# EAGLE design 450_mic (EAGLE 9.6.2)
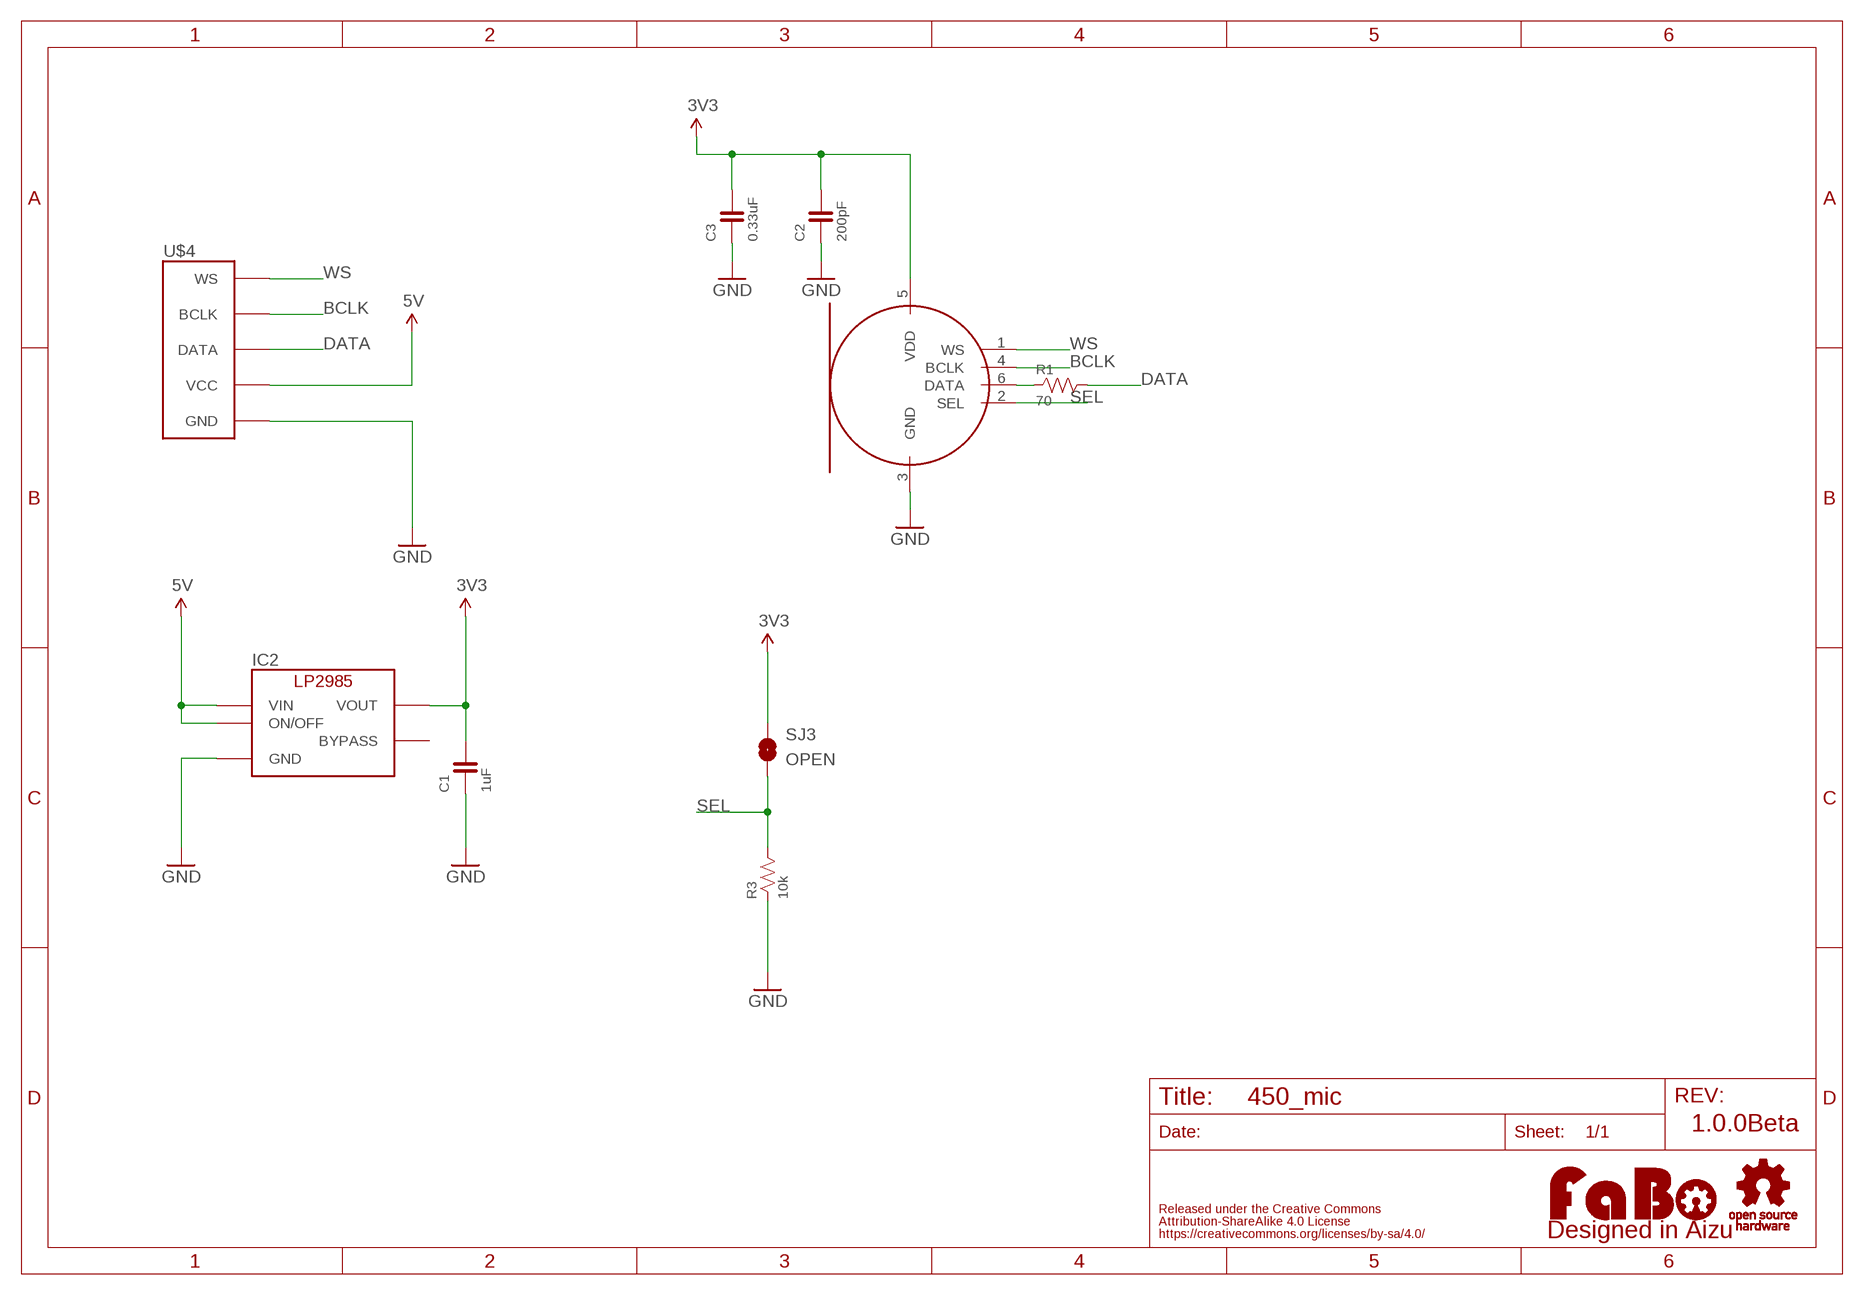
[diagram p0: schematic, sheet 1]

## Parts
C1  1uF  CAPACITOR-0603  [0603]
C2  200pF  CAPACITOR-0603  [0603]
C3  0.33uF  CAPACITOR-0603  [0603]
IC2  LP2985-33DBV  [SOT-23-5]
LOGO1  LOGO_FABO-M_BOTTOM  [LOGO_FABO_M_BOTTOM]
MIC1  KW-SPH0645  [KNOWLES-SPH0645]
R1  70  RESISTOR-0603  [0603]
R3  10k  RESISTOR-0603  [0603]
SJ3  OPEN  SMD-JUMPER-2-OPEN  [SMD-JUMPER-2-OPEN]
U$2  LOGO_OSHW-M_BOTTOM  [LOGO_OSHW_M_BOTTOM]
U$4  FABO_BRICK_I2S  [FABO_BRICK_I2S]

## Nets
3V3: C1.2 C2.2 C3.2 IC2.5(VOUT) MIC1.5(VDD) SJ3.1
5V: IC2.1(VIN) IC2.3(ON/OFF) U$4.VCC
BCLK: MIC1.4(BCLK) U$4.BCLK
DATA: R1.2 U$4.DATA
GND: C1.1 C2.1 C3.1 IC2.2(GND) MIC1.3(GND) R3.1 U$4.GND
N$6: MIC1.6(DATA) R1.1
SEL: MIC1.2(SEL) R3.2 SJ3.2
WS: MIC1.1(WS) U$4.WS
Unconnected: IC2.4(BYPASS)

## Notes on the sheet
- 1.0.0Beta

## Library data of the parts
C1-C3 = FaBo-Capacitor:CAPACITOR: CAPACITOR
IC2 = FaBo-Supply:LP2985: LP2985
LOGO1 = component:LOGO_FABO
MIC1 = FaBo-Mems:KW-SPH0645
R1 R3 = FaBo-Resistors:RESISTOR: RESISTOR
SJ3 = FaBo-Supply:SMD-JUMPER-2
U$2 = component:LOGO_OSHW
U$4 = FaBo-Template:FABO_BRICK_I2S

## Board
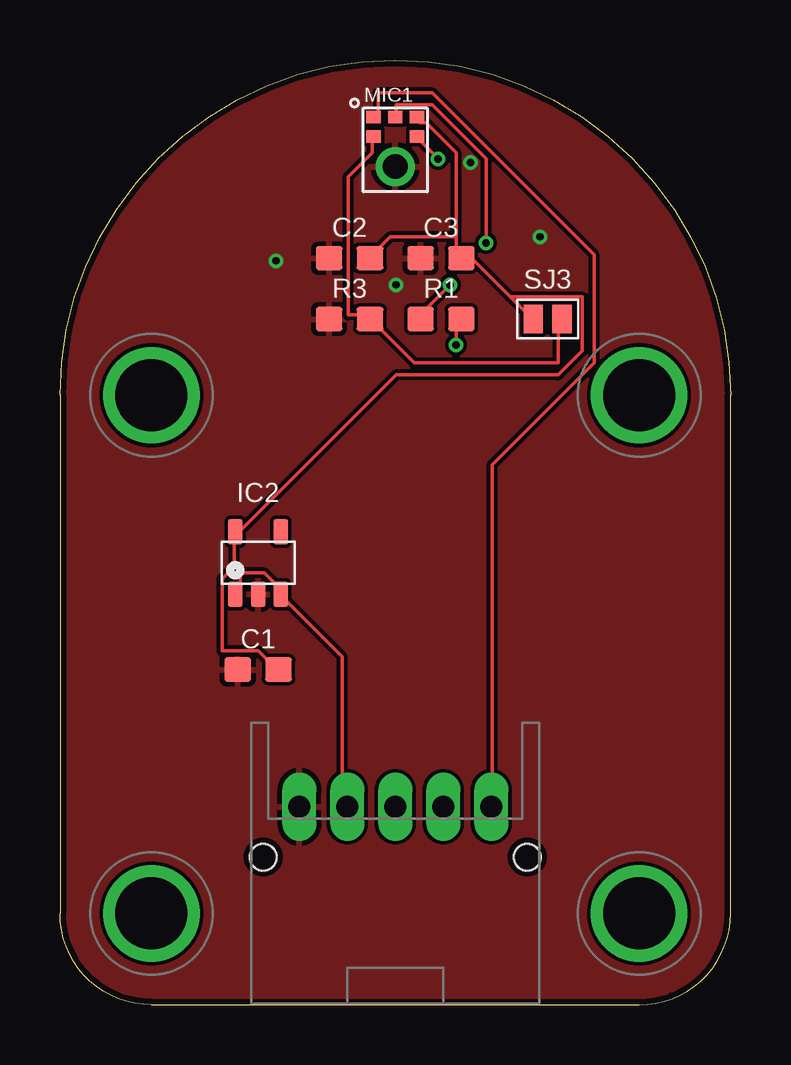
[diagram p1: board, top side]
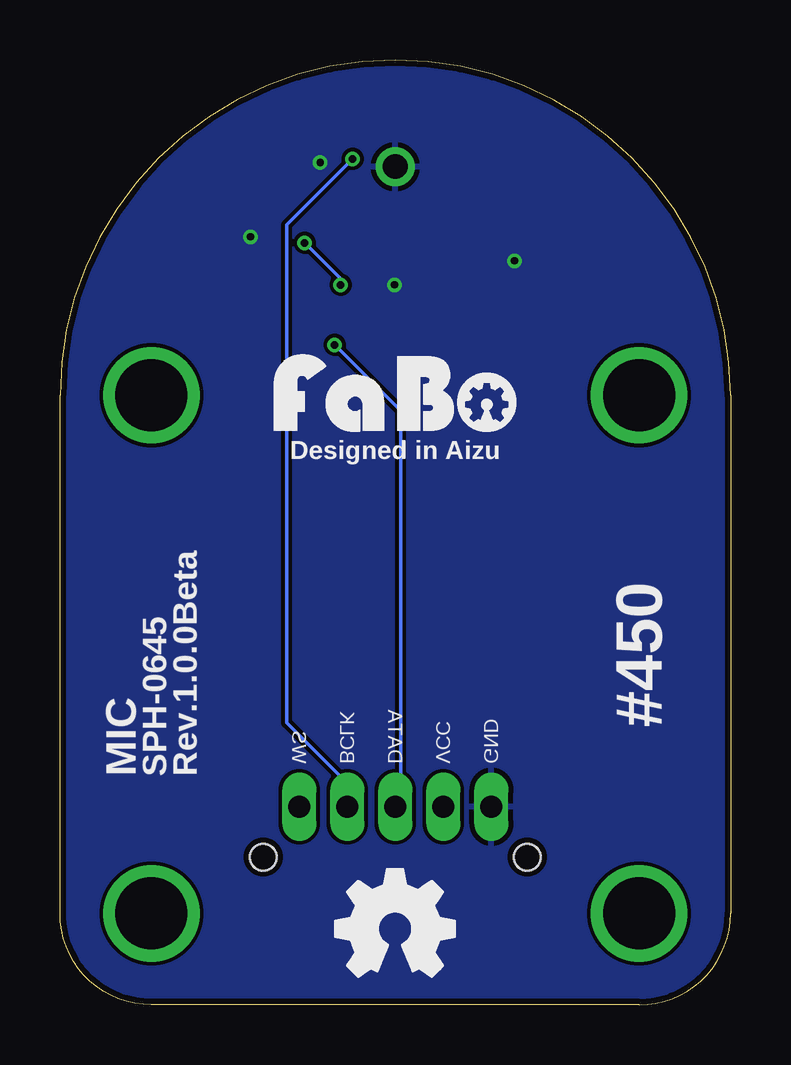
[diagram p2: board, bottom side, seen from below]

Size 27.94 x 39.37 mm. Coordinates in mm from the lower left corner, seen from the top.
Copper layers (1*16): Top 0.035mm / dielectric 1.6mm / Bottom 0.035mm
Design rules "PCBway": minimum track width 6mil, minimum drill 12mil, track to track 6mil, track to pad 6mil, pad to pad 6mil, via to via 6mil, smd to smd 6mil, copper to edge 10mil, drill to drill 10mil, minimum pad ring 10mil, minimum via ring 6mil, stop-mask expansion 2mil, vias tented up to drill 100mil, thermal gap 8mil

### Footprints (pad centres in the part's own frame; a part is rotated, then mirrored left to right if it is on the bottom)
0603 = smd 1.1 x 1: 1 -0.85,0; 2 0.85,0
SOT-23-5 = smd 0.6 x 1.05: 1 -0.95,-1.3; 2 0,-1.3; 3 0.95,-1.3; 4 0.95,1.3; 5 -0.95,1.3
KNOWLES-SPH0645 = smd 0.6 x 0.522: 1 -0.9,2.074; 2 -0.9,1.252; 4 0.9,1.252; 5 0.9,2.074; 6 0,2.074 | drill 1.024 pad 1.624: 3 0,0
SMD-JUMPER-2-OPEN = smd 0.8 x 1.2: 1 -0.6,0; 2 0.6,0
FABO_BRICK_I2S = drill 0.9 pad 1.422 long: BCLK 2,-9.525; DATA 0,-9.525; GND -4,-9.525; VCC -2,-9.525; WS 4,-9.525 | drill 3 pad 3.81: P$1 -10.16,7.62; P$2 10.16,7.62; P$3 -10.16,-13.97; P$4 10.16,-13.97 | hole 1.1: -5.5,-11.625; 5.5,-11.625

### Placement (x,y rotation side)
C1  8.26,13.97 0 top
C2  12.06,31.11 0 top
C3  15.88,31.11 0 top
IC2  8.26,18.41 0 top
LOGO1  13.97,23.5 0 top
MIC1  13.97,34.92 0 top
R1  15.88,28.57 0 top
R3  12.06,28.57 0 top
SJ3  20.32,28.57 0 top
U$2  13.97,3.17 0 top
U$4  13.97,17.78 0 top

### Tracks (layer width: path | path; a pad name or v marks a point on that pad's centre or on a via)
3V3
  Top 0.152: C1.2 9,14 8.25,14.75 6.75,14.75 6.75,17.75 7.25,18.25 7.25,19.5 IC2.5 7.5,19.75 14,26.25 20.75,26.25 21.75,27.25 21.75,29.5 18.75,29.5 | 16.5,32 16.5,31.25 C3.2 16.75,31 17.25,31 18.75,29.5 | 16.5,32 16.5,35.5 15.25,36.75 15,36.75 MIC1.5 | 16.5,32 13.75,32 13,31.25 C2.2 | 18.75,29.5 19.5,28.75 SJ3.1
5V
  Top 0.152: IC2.1 7.5,17.25 7.5,18 8.5,18 9.25,17.25 IC2.3 9.25,17 11.75,14.5 11.75,8.5 U$4.VCC
BCLK  (via drill 0.3)
  Top 0.152: v15.75,35.25 15,36 MIC1.4
  Bottom 0.152: v15.75,35.25 18.5,32.5 18.5,11.75 16,9.25 16,8.5 U$4.BCLK
DATA  (via drill 0.3)
  Top 0.152: v16.5,27.5 16.5,28.5 R1.2
  Bottom 0.152: v16.5,27.5 13.75,24.75 13.75,8.5 U$4.DATA
GND  (via drill 0.3)
  other vias: 9,31 20,32 14,30 17.1,35.1
  pour Top: 0,0 28,0 28,39.37 0,39.37
  pour Bottom: 0,0 28,0 28,39.37 0,39.37
N$6  (via drill 0.3)
  Top 0.152: v17.75,31.75 17.75,35.25 15.5,37.5 14,37.5 14,37 MIC1.6 | v16.25,30 15,28.75 R1.1
  Bottom 0.152: v17.75,31.75 16.25,30.25 v16.25,30
SEL
  Top 0.152: MIC1.2 13,36 13,35.5 12,34.5 12,28.75 12.75,28.75 R3.2 13,28.5 14.75,26.75 20.75,26.75 20.75,28.5 SJ3.2
WS
  Top 0.152: MIC1.1 13.25,37 13.25,38 15.5,38 22.25,31.25 22.25,26.75 18,22.5 18,8.5 U$4.WS

### Text on the board
bPlace: Designed in Aizu | #450 | Rev.1.0.0Beta | SPH-0645 | MIC